# Altium schematic sheet STM32_microcontroller_power.SchDoc: STM32_microcontroller_power
size A4; Date: Not used; ApprovedBy: Not used; CheckedBy: Not used; Author: Not used; CompanyName: STMicroelectronics; DrawnBy: Not used; Engineer: Not used; Organization: Not used; Address1: Not used; Address2: Not used; Address3: Not used; Address4: Not used; DocumentNumber: 4; Revision: Not used; SheetNumber: 4; SheetTotal: 9; CurrentTime: Not used; CurrentDate: Not used; Time: Not used; DocumentFullPathAndName: Not used; DocumentName: Not used; ModifiedDate: Not used; ImagePath: Not used; ProjectName: Not used; Application_BuildNumber: Not used
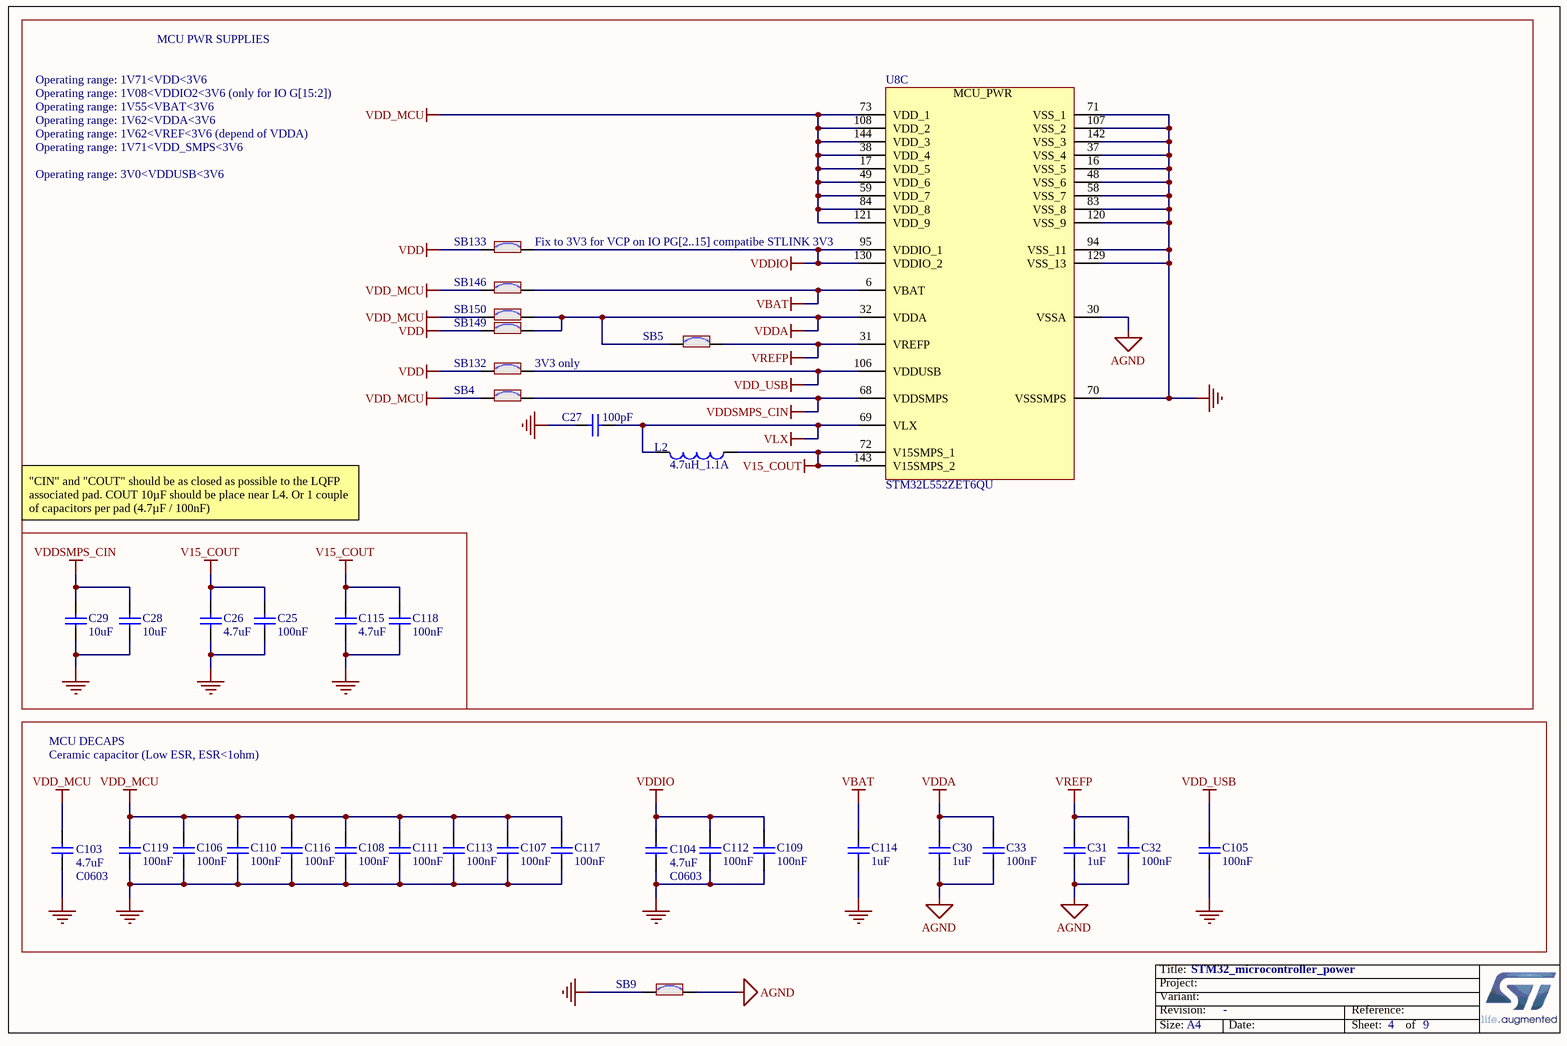
[diagram p0: STM32_microcontroller_power.SchDoc]

## Parts
C25  value 100nF  [C0402]  (hidden comment: Capacitor)
C26  value 4.7uF  [C0402]
C27  value 100pF  [C0402]
C28  value 10uF  [C0402]
C29  value 10uF  [C0402]
C30  value 1uF  [C0603]  (hidden comment: Capacitor)
C31  value 1uF  [C0603]  (hidden comment: Capacitor)
C32  value 100nF  [C0402]  (hidden comment: Capacitor)
C33  value 100nF  [C0402]  (hidden comment: Capacitor)
C103  value 4.7uF  [C0603]
C104  value 4.7uF  [C0603]
C105  value 100nF  [C0402]  (hidden comment: Capacitor)
C106  value 100nF  [C0402]  (hidden comment: Capacitor)
C107  value 100nF  [C0402]  (hidden comment: Capacitor)
C108  value 100nF  [C0402]  (hidden comment: Capacitor)
C109  value 100nF  [C0402]  (hidden comment: Capacitor)
C110  value 100nF  [C0402]  (hidden comment: Capacitor)
C111  value 100nF  [C0402]  (hidden comment: Capacitor)
C112  value 100nF  [C0402]  (hidden comment: Capacitor)
C113  value 100nF  [C0402]  (hidden comment: Capacitor)
C114  value 1uF  [C0603]  (hidden comment: Capacitor)
C115  value 4.7uF  [C0402]
C116  value 100nF  [C0402]  (hidden comment: Capacitor)
C117  value 100nF  [C0402]  (hidden comment: Capacitor)
C118  value 100nF  [C0402]  (hidden comment: Capacitor)
C119  value 100nF  [C0402]  (hidden comment: Capacitor)
L2  value 4.7uH_1.1A  [IND_TDK_MLP2016H4R7MT0S1]  (hidden comment: Inductor)
SB4  (no value)  [SOLDER-BRIDGE_R0603-0R]
SB5  (no value)  [SOLDER-BRIDGE_R0603-0R]
SB9  (no value)  [SOLDER-BRIDGE_R0603-0R]
SB132  (no value)  [SOLDER-BRIDGE_R0603-0R]
SB133  (no value)  [SOLDER-BRIDGE_R0603-0R]
SB146  (no value)  [SOLDER-BRIDGE_R0603-0R]
SB149  (no value)  [SOLDER-BRIDGE_R0603-0R]
SB150  (no value)  [SOLDER-BRIDGE_R0603-0R]
U8  STM32L552ZET6QU  [ICC_LQFP144_20X20_P050]  (part C of 3)

## Nets
AGND: C30.2 C31.2 C32.1 C33.1 SB9.2 U8.30(VSSA)
GND: C25.1 C26.1 C27.1 C28.1 C29.1 C103.1 C104.1 C105.1 C106.1 C107.1 C108.1 C109.1 C110.1 C111.1 C112.1 C113.1 C114.1 C115.1 C116.1 C117.1 C118.1 C119.1 SB9.1 U8.16(VSS_5) U8.37(VSS_4) U8.48(VSS_6) U8.58(VSS_7) U8.70(VSSSMPS) U8.71(VSS_1) U8.83(VSS_8) U8.94(VSS_11) U8.107(VSS_2) U8.120(VSS_9) U8.129(VSS_13) U8.142(VSS_3)
V15_COUT: C25.2 C26.2 C115.2 C118.2 L2.1 U8.72(V15SMPS_1) U8.143(V15SMPS_2)
VBAT: C114.2 SB146.2 U8.6(VBAT)
VDD: SB132.1 SB133.1 SB149.1
VDD_MCU: C103.2 C106.2 C107.2 C108.2 C110.2 C111.2 C113.2 C116.2 C117.2 C119.2 SB4.1 SB146.1 SB150.1 U8.17(VDD_5) U8.38(VDD_4) U8.49(VDD_6) U8.59(VDD_7) U8.73(VDD_1) U8.84(VDD_8) U8.108(VDD_2) U8.121(VDD_9) U8.144(VDD_3)
VDD_USB: C105.2 SB132.2 U8.106(VDDUSB)
VDDA: C30.1 C33.2 SB5.1 SB149.2 SB150.2 U8.32(VDDA)
VDDIO: C104.2 C109.2 C112.2 SB133.2 U8.95(VDDIO_1) U8.130(VDDIO_2)
VDDSMPS_CIN: C28.2 C29.2 SB4.2 U8.68(VDDSMPS)
VLX: C27.2 L2.2 U8.69(VLX)
VREFP: C31.1 C32.2 SB5.2 U8.31(VREFP)

## Notes on the sheet
- MCU PWR SUPPLIES
- Operating range: 1V71<VDD<3V6
- Operating range: 1V08<VDDIO2<3V6 (only for IO G[15:2])
- Operating range: 1V55<VBAT<3V6
- Operating range: 1V62<VDDA<3V6
- Operating range: 3V0<VDDUSB<3V6
- Operating range: 1V71<VDD_SMPS<3V6
- Operating range: 1V62<VREF<3V6 (depend of VDDA)
- Fix to 3V3 for VCP on IO PG[2..15] compatibe STLINK 3V3
- (near SB132) 3V3 only
- "CIN" and "COUT" should be as closed as possible to the LQFP associated pad. COUT 10µF should be place near L4. Or 1 couple of capacitors per pad (4.7µF / 100nF)
- MCU DECAPS
- Ceramic capacitor (Low ESR, ESR<1ohm)
- Title:
- Project:
- Size:
- Revision:
- Variant:
- A4
- -
- Date:
- Reference:
- Sheet:
- of
- (in symbol MCD-01055, part C) MCU_PWR

## Library data of the parts
C25 C32 C33 C105-C113 C116-C119 = MCD-00102: Capacitor, MLCC, 100nF, 16V, X7R, 10%, 0402, T=0,5mm; Manufacturer_Part_Number: CC0402KRX7R7BB104; Manufacturer: YAGEO; Alternate_Manufacturer_Part_Number: GCM155R71C104KA55D; Alternate_Manufacturer: MURATA; Provided_By: SUBCO; Internal_Part_Number: MCD-00102; Status: Released; Part_Type: Capacitor; Package: C0402; ComponentLink1Description: Datasheet; ComponentLink1URL: http://tunmcdsvn.tun.st.com/Component_Datasheet_Library/Trunk/Capacitors/Yageo_Multilayer_Capacitor_X7R_series_100pF_to_22uF
C26 C115 = MCD-01356: Capacitor, MLCC, 4.7uF, 6V3, X5R, 20%, 0402, T=0,5mm; Manufacturer_Part_Number: GRM155R60J475ME47; Manufacturer: MURATA; ECCN_US: EAR99; ECCN_EU: NEC; Provided_By: Subcon; Initial_Board_Reference: MB1372; Internal_Part_Number: MCD-01356; Status: Checked; Part_Type: Capacitor; Package: C0402; ComponentLink1Description: Datasheet; ComponentLink1URL: http://tunmcdsvn.tun.st.com/Component_Datasheet_Library/Trunk/Capacitors/Murata_Capacitor_GR_series
C27 = MCD-00205: Capacitor, MLCC, 100pF, 50V, NPO, 5%, 0402, T=0,5mm; Manufacturer_Part_Number: CC0402JRNPO9BN101; Manufacturer: YAGEO; Provided_By: Subcon; Initial_Board_Reference: MB1361; Internal_Part_Number: MCD-00205; Status: Released; Part_Type: Capacitor; Package: C0402; ComponentLink1Description: Datasheet; ComponentLink1URL: http://tunmcdsvn.tun.st.com/Component_Datasheet_Library/Trunk/Capacitors/Yageo_Capacitor_NP0_16V-to-50V; ECCN_US: n/a; ECCN_EU: n/a
C28 C29 = MCD-01355: Capacitor, MLCC, 10uF, 4V, X5R, 20%, 0402, T=0,5mm; Manufacturer_Part_Number: GRM155R60G106ME44; Manufacturer: MURATA; ECCN_US: EAR99; ECCN_EU: NEC; Provided_By: Subcon; Initial_Board_Reference: MB1372; Internal_Part_Number: MCD-01355; Status: Checked; Part_Type: Capacitor; Package: C0402; ComponentLink1Description: Datasheet; ComponentLink1URL: http://tunmcdsvn.tun.st.com/Component_Datasheet_Library/Trunk/Capacitors/Murata_Capacitor_GR_series
C30 C31 C114 = MCD-00010: Capacitor, MLCC, 1uF, 16V, X5R, 10%, 0603, T=0,8mm; Manufacturer_Part_Number: CC0603KRX5R7BB105; Manufacturer: YAGEO; Provided_By: SUBCO; Internal_Part_Number: MCD-00010; Status: Released; Part_Type: Capacitor; Package: C0603; ComponentLink1Description: Datasheet; ComponentLink1URL: http://tunmcdsvn.tun.st.com/Component_Datasheet_Library/Trunk/Capacitors/Yageo_Multilayer_capacitor_X5R_series_100pF_to_100uF
C103 C104 = MCD-01121: Capacitor, MLCC, 4.7µF, 10V, X5R, 20%, 0603, T=0,8mm; Manufacturer_Part_Number: GRM188R61A475ME15; Manufacturer: MURATA; ECCN_US: EAR99; ECCN_EU: NEC; Provided_By: Subcon; Initial_Board_Reference: MB1361; Internal_Part_Number: MCD-01121; Status: Released; Part_Type: Capacitor; Package: C0603; ComponentLink1Description: Datasheet; ComponentLink1URL: http://tunmcdsvn.tun.st.com/Component_Datasheet_Library/Trunk/Capacitors/Murata_Capacitor_GR_series
L2 = MCD-01786: Power Inductor 4.7uH 1.1A 160 mOHM 20% SMD Multilayer ferrite.; Manufacturer_Part_Number: MLP2016H4R7MT0S1; Manufacturer: TDK; Provided_By: SUBCO; Internal_Part_Number: MCD-01786; Status: Checked; Part_Type: Inductor; Package: L0806; ComponentLink1Description: Datasheet; ComponentLink1URL: http://tunmcdsvn.tun.st.com/Component_Datasheet_Library/Trunk/Inductors/TDK_Power_inductor_MLP2016_series; ECCN_US: n/a; ECCN_EU: n/a
SB4 SB5 SB9 SB132 SB133 SB146 SB149 SB150 = MCD-00071: Solder Bridge ON; Part_Type: Mechanical; Provided_By: Subcon; Initial_Board_Reference: MB1274; Internal_Part_Number: MCD-00071; ECCN_US: n/a; ECCN_EU: n/a; Status: Released; ComponentLink1Description: Datasheet
U8 = MCD-01055: STM32L552ZET6Q MCU,LQFP144 20x20, 0.5, no AES, Q for Int SMPS; Part_Type: IC; Manufacturer: STMICROELECTRONICS; BMS_Part_Number: 9175310; ECCN_US: 3A991A2; ECCN_EU: NEC; Provided_By: SUBCO with ST control; Internal_Part_Number: MCD-01055; Value: STM32L552ZET6QU; Status: Released; Manufacturer_Part_Number: STM32L552ZET6QU; Package: LQFP144; ComponentLink1Description: Datasheet; ComponentLink1URL: http://tunmcdsvn.tun.st.com/Component_Datasheet_Library/Trunk/IC/STM_STM32L552ZET6QU